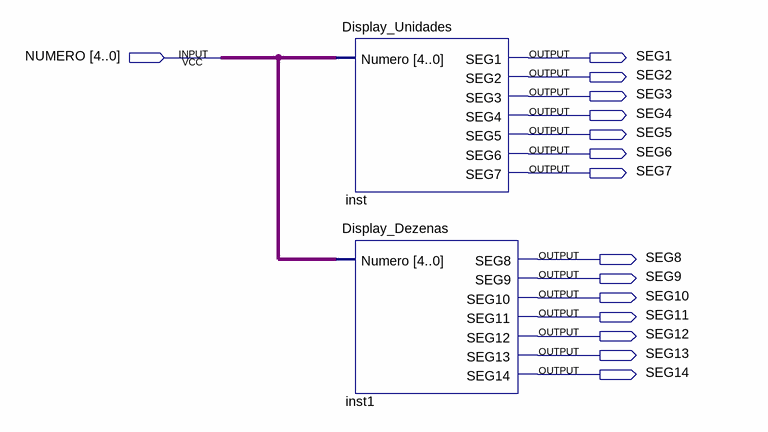
[diagram p0: schematic sheet]
// Quartus schematic Display_Total.bdf as structural Verilog: 2 symbols, 15 pins
module Display_Total (
  input  [4:0] NUMERO,
  output SEG1,
  output SEG2,
  output SEG3,
  output SEG4,
  output SEG5,
  output SEG6,
  output SEG7,
  output SEG8,
  output SEG9,
  output SEG10,
  output SEG11,
  output SEG12,
  output SEG13,
  output SEG14
);

  Display_Unidades inst (
    .Numero(NUMERO), .SEG1(SEG1), .SEG2(SEG2), .SEG3(SEG3), .SEG4(SEG4), .SEG5(SEG5), .SEG6(SEG6), .SEG7(SEG7));
  Display_Dezenas inst1 (
    .Numero(NUMERO), .SEG8(SEG8), .SEG9(SEG9), .SEG10(SEG10), .SEG11(SEG11), .SEG12(SEG12), .SEG13(SEG13),
    .SEG14(SEG14));
endmodule
